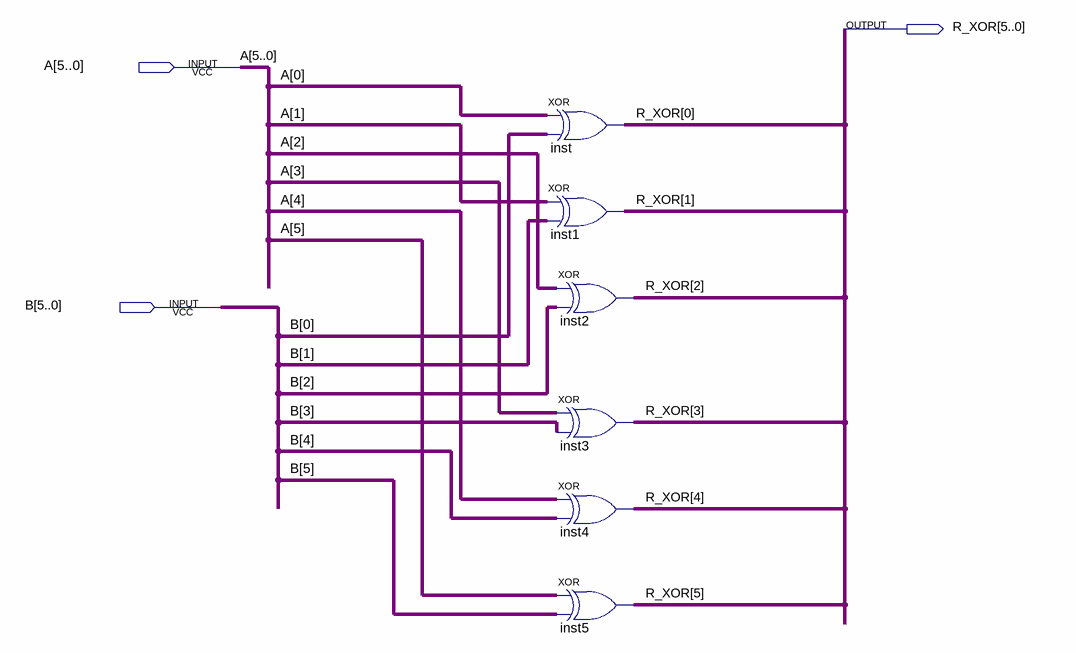
[diagram p0: schematic sheet]
// Quartus schematic AND.bdf as structural Verilog: 6 symbols, 3 pins
module AND (
  input  [5:0] A,
  input  [5:0] B,
  output [5:0] R_XOR
);

  xor inst (R_XOR[0], A[0], B[0]);
  xor inst1 (R_XOR[1], A[1], B[1]);
  xor inst2 (R_XOR[2], A[2], B[2]);
  xor inst3 (R_XOR[3], A[3], B[3]);
  xor inst4 (R_XOR[4], A[4], B[4]);
  xor inst5 (R_XOR[5], A[5], B[5]);
endmodule
